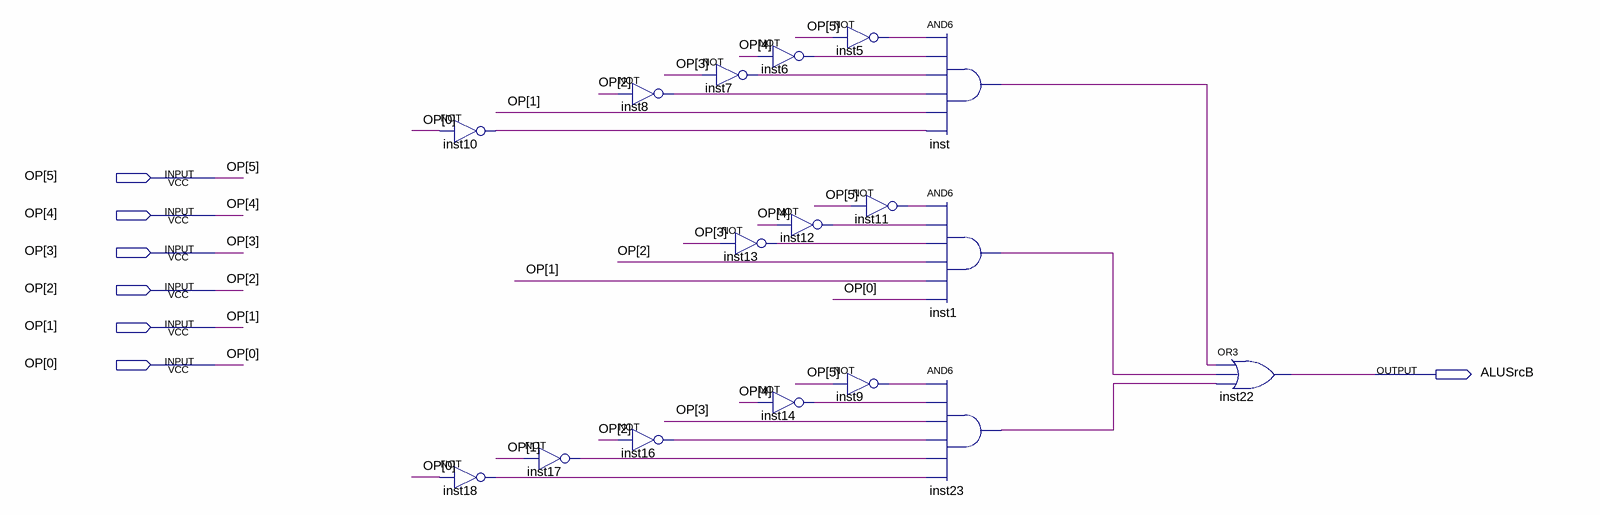
[diagram p0: schematic sheet]
// Quartus schematic ALUSrcB.bdf as structural Verilog: 17 symbols, 7 pins
module ALUSrcB (
  input  [5:0] OP,
  output ALUSrcB
);

  wire inst1_out, inst5_out, inst6_out, inst7_out, inst8_out, inst9_out, inst10_out, inst11_out, inst12_out,
       inst13_out, inst14_out, inst16_out, inst17_out, inst18_out, inst23_out, inst_out;

  not inst10 (inst10_out, OP[0]);
  not inst18 (inst18_out, OP[0]);
  not inst17 (inst17_out, OP[1]);
  not inst8 (inst8_out, OP[2]);
  not inst16 (inst16_out, OP[2]);
  not inst7 (inst7_out, OP[3]);
  not inst13 (inst13_out, OP[3]);
  not inst6 (inst6_out, OP[4]);
  not inst12 (inst12_out, OP[4]);
  not inst14 (inst14_out, OP[4]);
  not inst5 (inst5_out, OP[5]);
  not inst11 (inst11_out, OP[5]);
  not inst9 (inst9_out, OP[5]);
  and inst (inst_out, inst5_out, inst6_out, inst7_out, inst8_out, OP[1], inst10_out);
  and inst1 (inst1_out, inst11_out, inst12_out, inst13_out, OP[2], OP[1], OP[0]);
  and inst23 (inst23_out, inst9_out, inst14_out, OP[3], inst16_out, inst17_out, inst18_out);
  or inst22 (ALUSrcB, inst_out, inst1_out, inst23_out);
endmodule
